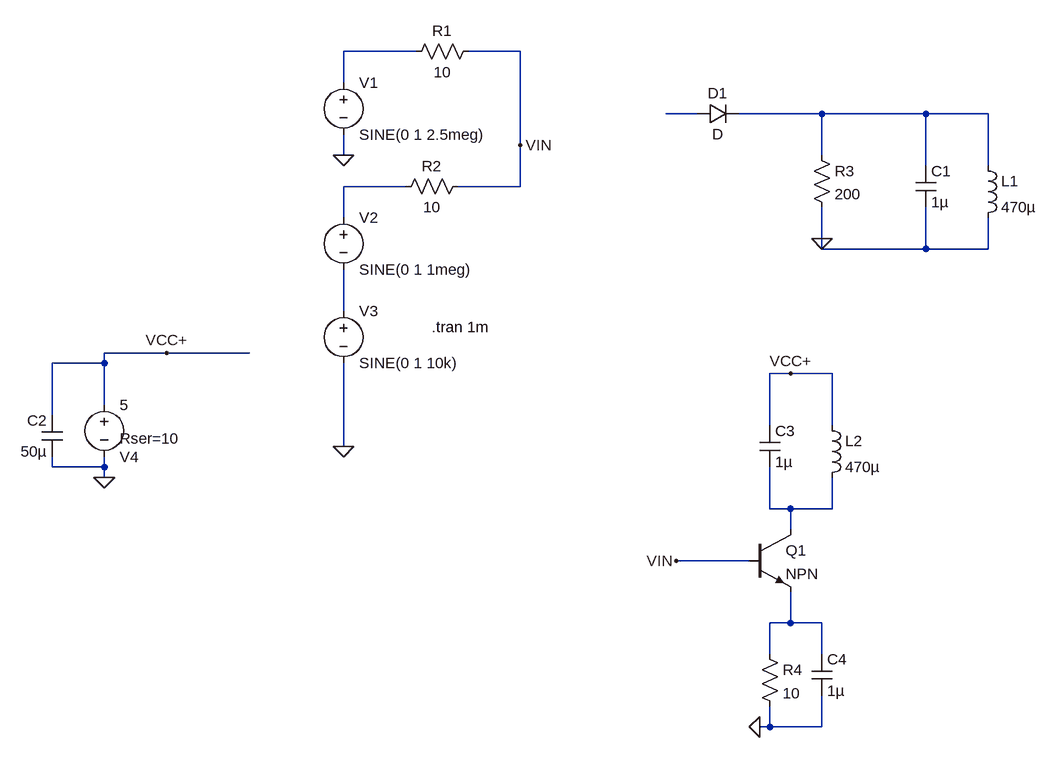
[diagram p0: schematic mixer.asc]
mixer.asc, the LTspice schematic file:
Version 4
SHEET 1 916 1060
WIRE -48 0 -160 0
WIRE 112 0 32 0
WIRE -160 48 -160 0
WIRE 384 96 336 96
WIRE 576 96 448 96
WIRE 736 96 576 96
WIRE 832 96 736 96
WIRE 112 144 112 0
WIRE -160 160 -160 128
WIRE 576 160 576 96
WIRE 736 176 736 96
WIRE 832 176 832 96
WIRE -64 208 -160 208
WIRE 112 208 112 144
WIRE 112 208 16 208
WIRE -160 256 -160 208
WIRE 576 288 576 240
WIRE 576 304 576 288
WIRE 736 304 736 240
WIRE 736 304 576 304
WIRE 832 304 832 256
WIRE 832 304 736 304
WIRE -160 400 -160 336
WIRE -432 464 -528 464
WIRE -304 464 -432 464
WIRE -528 480 -528 464
WIRE -528 480 -608 480
WIRE 528 496 496 496
WIRE 592 496 528 496
WIRE -528 544 -528 480
WIRE -608 560 -608 480
WIRE 496 576 496 496
WIRE 592 576 592 496
WIRE -160 608 -160 480
WIRE -608 640 -608 624
WIRE -528 640 -528 624
WIRE -528 640 -608 640
WIRE -528 656 -528 640
WIRE 496 704 496 640
WIRE 528 704 496 704
WIRE 592 704 592 656
WIRE 592 704 528 704
WIRE 528 736 528 704
WIRE 464 784 352 784
WIRE 528 880 528 832
WIRE 528 880 496 880
WIRE 576 880 528 880
WIRE 496 928 496 880
WIRE 576 928 576 880
WIRE 496 1040 496 1008
WIRE 496 1040 480 1040
WIRE 576 1040 576 992
WIRE 576 1040 496 1040
FLAG -160 160 0
FLAG -160 608 0
FLAG 576 288 0
FLAG -432 464 VCC+
FLAG -528 656 0
FLAG 528 496 VCC+
FLAG 112 144 VIN
FLAG 352 784 VIN
FLAG 480 1040 0
SYMBOL voltage -160 32 R0
WINDOW 123 0 0 Left 0
WINDOW 39 0 0 Left 0
SYMATTR InstName V1
SYMATTR Value SINE(0 1 2.5meg)
SYMBOL voltage -160 240 R0
WINDOW 123 0 0 Left 0
WINDOW 39 0 0 Left 0
SYMATTR InstName V2
SYMATTR Value SINE(0 1 1meg)
SYMBOL res 48 -16 R90
WINDOW 0 0 56 VBottom 2
WINDOW 3 32 56 VTop 2
SYMATTR InstName R1
SYMATTR Value 10
SYMBOL res 32 192 R90
WINDOW 0 0 56 VBottom 2
WINDOW 3 32 56 VTop 2
SYMATTR InstName R2
SYMATTR Value 10
SYMBOL diode 384 112 R270
WINDOW 0 32 32 VTop 2
WINDOW 3 0 32 VBottom 2
SYMATTR InstName D1
SYMBOL cap 720 176 R0
SYMATTR InstName C1
SYMATTR Value 1µ
SYMBOL ind 816 160 R0
SYMATTR InstName L1
SYMATTR Value 470µ
SYMBOL voltage -160 384 R0
WINDOW 123 0 0 Left 0
WINDOW 39 0 0 Left 0
SYMATTR InstName V3
SYMATTR Value SINE(0 1 10k)
SYMBOL res 560 144 R0
SYMATTR InstName R3
SYMATTR Value 200
SYMBOL npn 464 736 R0
SYMATTR InstName Q1
SYMBOL voltage -528 528 R0
WINDOW 0 24 96 Left 2
WINDOW 3 24 16 Left 2
WINDOW 123 0 0 Left 0
WINDOW 39 24 68 Left 2
SYMATTR InstName V4
SYMATTR Value 5
SYMATTR SpiceLine Rser=10
SYMBOL cap -592 624 R180
WINDOW 0 24 56 Left 2
WINDOW 3 24 8 Left 2
SYMATTR InstName C2
SYMATTR Value 50µ
SYMBOL cap 480 576 R0
SYMATTR InstName C3
SYMATTR Value 1µ
SYMBOL ind 576 560 R0
SYMATTR InstName L2
SYMATTR Value 470µ
SYMBOL res 480 912 R0
SYMATTR InstName R4
SYMATTR Value 10
SYMBOL cap 560 928 R0
SYMATTR InstName C4
SYMATTR Value 1µ
TEXT -24 424 Left 2 !.tran 1m

The netlist it stands for:
* mixer.asc
V1 N001 0 SINE(0 1 2.5meg)
V2 N004 N005 SINE(0 1 1meg)
R1 VIN N001 10
R2 VIN N004 10
D1 N002 N003 D
C1 N003 0 1µ
L1 N003 0 470µ
V3 N005 0 SINE(0 1 10k)
R3 N003 0 200
Q1 N006 VIN N007 0 NPN
V4 VCC+ 0 5 Rser=10
C2 0 VCC+ 50µ
C3 VCC+ N006 1µ
L2 VCC+ N006 470µ
R4 N007 0 10
C4 N007 0 1µ
.model D D
.lib standard.dio
.model NPN NPN
.model PNP PNP
.lib standard.bjt
.tran 1m
.backanno
.end